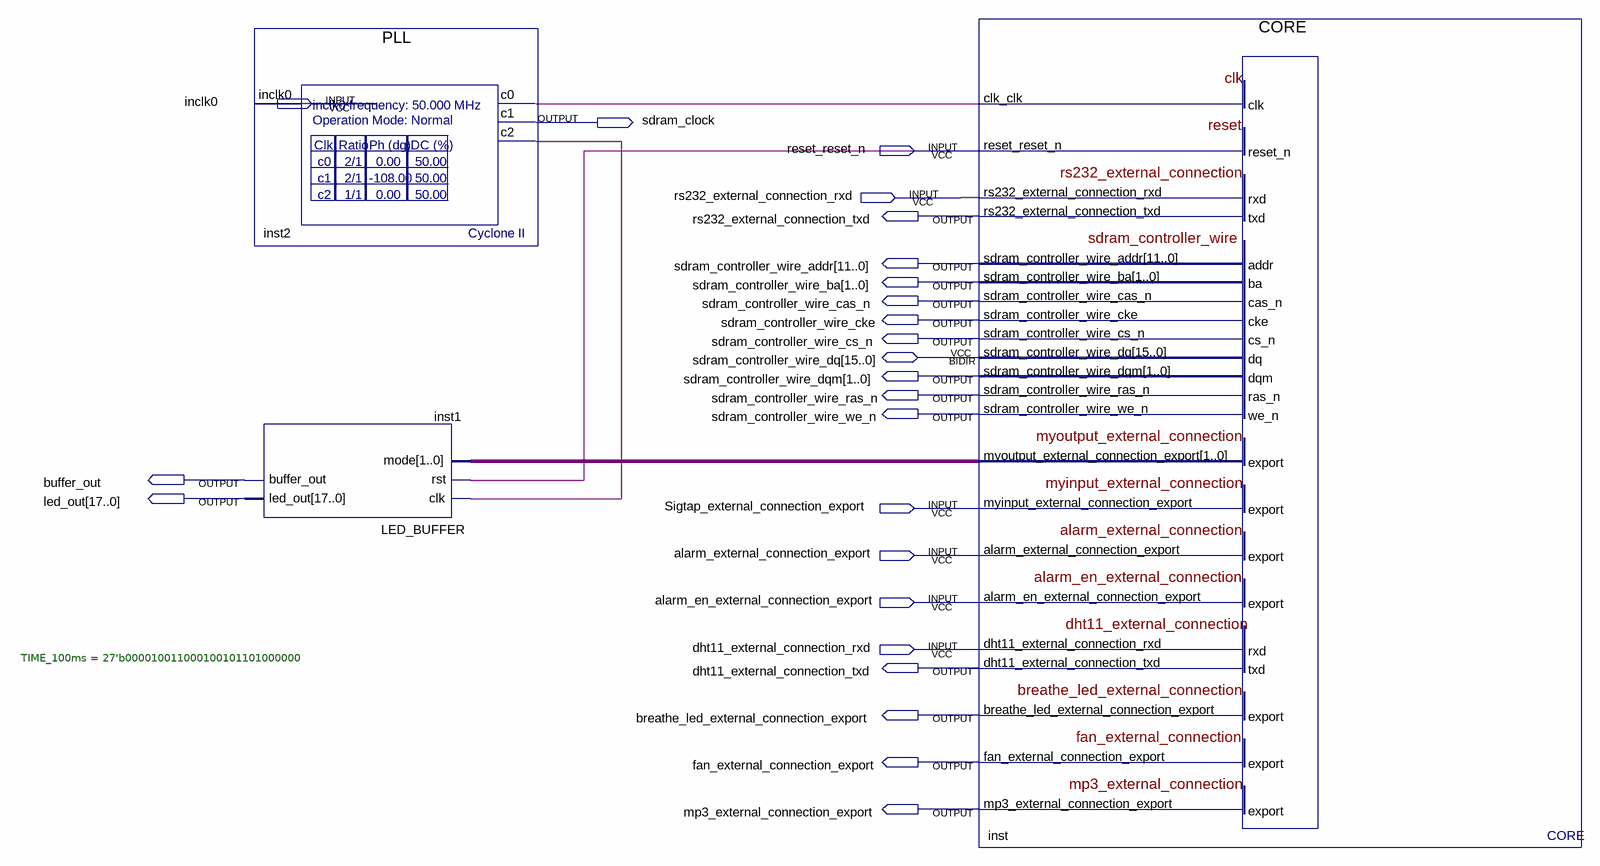
[diagram p0: schematic sheet]
// Quartus schematic sdram_uart.bdf as structural Verilog: 3 symbols, 24 pins
module sdram_uart (
  input  inclk0,
  input  reset_reset_n,
  input  rs232_external_connection_rxd,
  input  Sigtap_external_connection_export,
  input  alarm_external_connection_export,
  input  alarm_en_external_connection_export,
  input  dht11_external_connection_rxd,
  inout  [15:0] sdram_controller_wire_dq,
  output sdram_clock,
  output rs232_external_connection_txd,
  output [11:0] sdram_controller_wire_addr,
  output [1:0] sdram_controller_wire_ba,
  output sdram_controller_wire_cas_n,
  output sdram_controller_wire_cke,
  output sdram_controller_wire_cs_n,
  output [1:0] sdram_controller_wire_dqm,
  output sdram_controller_wire_ras_n,
  output sdram_controller_wire_we_n,
  output buffer_out,
  output [17:0] led_out,
  output dht11_external_connection_txd,
  output breathe_led_external_connection_export,
  output fan_external_connection_export,
  output mp3_external_connection_export
);

  wire inst2_c0, inst2_c2;
  wire [1:0] inst_myoutput_external_connection_export;

  PLL inst2 (.inclk0(inclk0), .c0(inst2_c0), .c1(sdram_clock), .c2(inst2_c2));
  LED_BUFFER #(.TIME_100ms(27'b000010011000100101101000000)) inst1 (
    .clk(inst2_c2), .rst(reset_reset_n), .mode(inst_myoutput_external_connection_export), .led_out(led_out),
    .buffer_out(buffer_out));
  CORE inst (
    .clk_clk(inst2_c0), .reset_reset_n(reset_reset_n),
    .rs232_external_connection_rxd(rs232_external_connection_rxd),
    .myinput_external_connection_export(Sigtap_external_connection_export),
    .alarm_external_connection_export(alarm_external_connection_export),
    .alarm_en_external_connection_export(alarm_en_external_connection_export),
    .dht11_external_connection_rxd(dht11_external_connection_rxd),
    .rs232_external_connection_txd(rs232_external_connection_txd),
    .sdram_controller_wire_addr(sdram_controller_wire_addr),
    .sdram_controller_wire_ba(sdram_controller_wire_ba),
    .sdram_controller_wire_cas_n(sdram_controller_wire_cas_n),
    .sdram_controller_wire_cke(sdram_controller_wire_cke),
    .sdram_controller_wire_cs_n(sdram_controller_wire_cs_n),
    .sdram_controller_wire_dqm(sdram_controller_wire_dqm),
    .sdram_controller_wire_ras_n(sdram_controller_wire_ras_n),
    .sdram_controller_wire_we_n(sdram_controller_wire_we_n),
    .myoutput_external_connection_export(inst_myoutput_external_connection_export),
    .dht11_external_connection_txd(dht11_external_connection_txd),
    .breathe_led_external_connection_export(breathe_led_external_connection_export),
    .fan_external_connection_export(fan_external_connection_export),
    .mp3_external_connection_export(mp3_external_connection_export),
    .sdram_controller_wire_dq(sdram_controller_wire_dq));
endmodule
